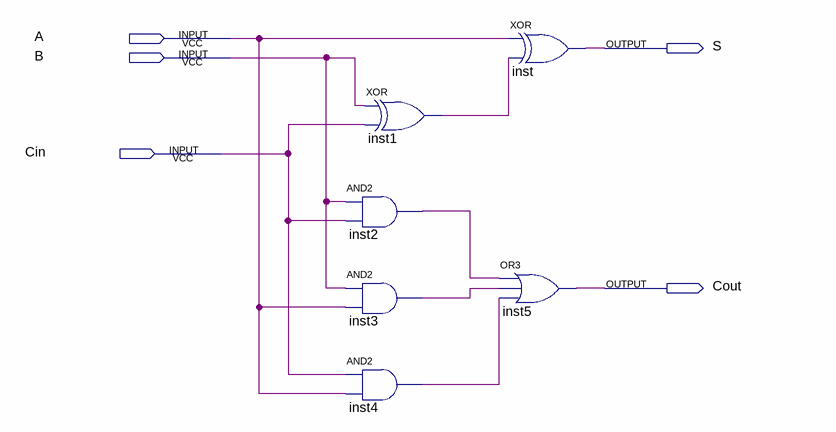
[diagram p0: schematic sheet]
// Quartus schematic somador.bdf as structural Verilog: 6 symbols, 5 pins
module somador (
  input  A,
  input  B,
  input  Cin,
  output S,
  output Cout
);

  wire inst1_out, inst2_out, inst3_out, inst4_out;

  xor inst1 (inst1_out, B, Cin);
  and inst2 (inst2_out, B, Cin);
  and inst3 (inst3_out, B, A);
  and inst4 (inst4_out, Cin, A);
  xor inst (S, A, inst1_out);
  or inst5 (Cout, inst2_out, inst3_out, inst4_out);
endmodule
